# EAGLE schematic Battery_Board_v3.0 (EAGLE 9.6.2)
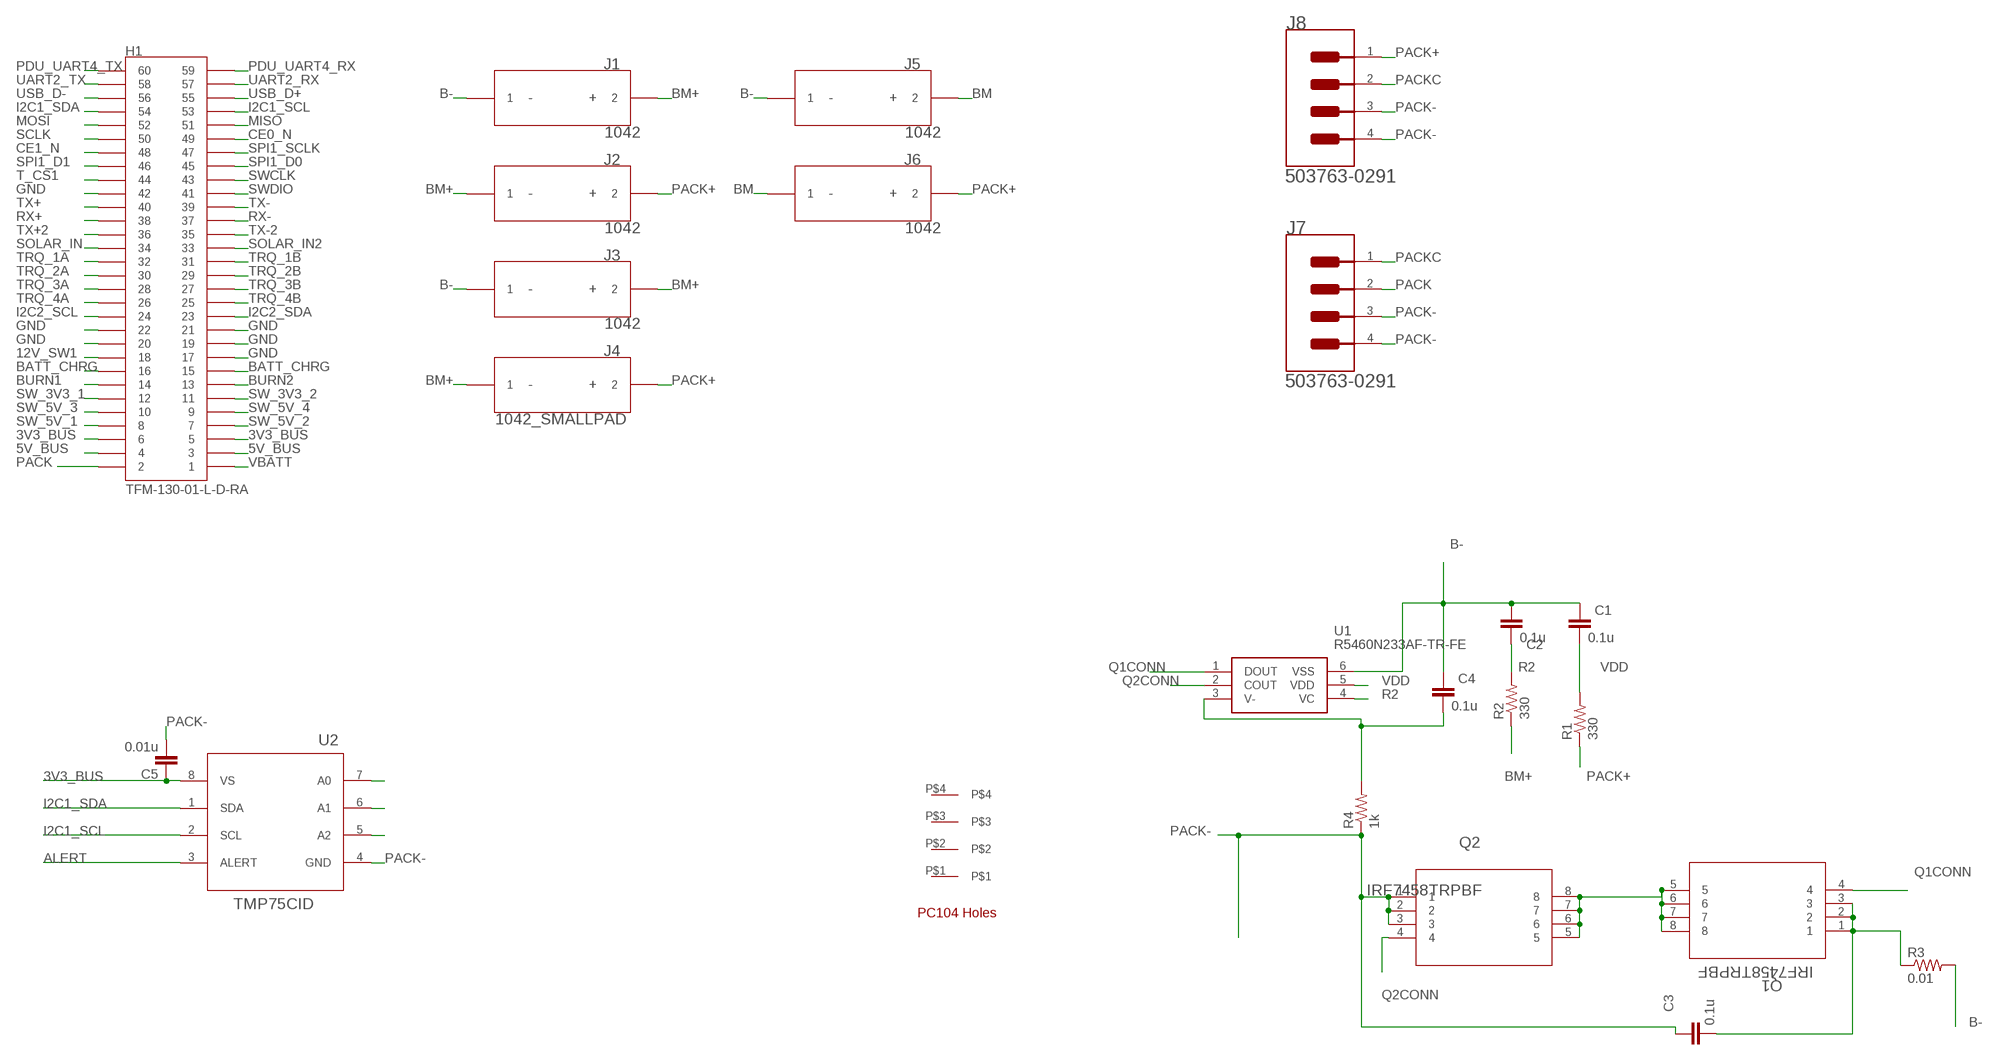
[diagram p0: schematic, sheet 1]

## Parts
C1  0.1u  CAP0603-CAP  [0603-CAP]
C2  0.1u  CAP0603-CAP  [0603-CAP]
C3  0.1u  CAP0603-CAP  [0603-CAP]
C4  0.1u  CAP0603-CAP  [0603-CAP]
C5  0.01u  CAP0805  [0805]
H1  TFM-130-01-L-D-RA  [60_PIN]
J1  1042  [1042_KEY]
J2  1042  [1042_KEY]
J3  1042  [1042_KEY]
J4  1042_SMALLPAD  [1042_KEY_SMALLPAD]
J5  1042  [1042_KEY]
J6  1042  [1042_KEY]
J7  MOLEX_503763-0291MOLEX_503763-0291_0_0  [MOLEX_503763-0291_0]
J8  MOLEX_503763-0291MOLEX_503763-0291_0_0  [MOLEX_503763-0291_0]
Q1  IRF7458TRPBF  [SO-8_IRF7458_3P9X4P9_INF]
Q2  IRF7458TRPBF  [SO-8_IRF7458_3P9X4P9_INF]
R1  330  RESISTOR0603-RES  [0603-RES]
R2  330  RESISTOR0603-RES  [0603-RES]
R3  0.01  RESISTOR2512  [R2512]
R4  1k  RESISTOR0603-RES  [0603-RES]
U1  R5460N233AF-TR-FE  [SOT95P280X140-6N]
U2  TMP75CID  [D0008A_N]
U$1  PC104_HOLES  [PC104_HOLES]

## Nets
3V3_BUS: C5.1 H1.5 H1.6 U2.8(VS)
5V_BUS: H1.3 H1.4
12V_SW1: H1.18
ALERT: U2.3(ALERT)
B-: C1.1 C2.1 C4.1 J1.1 J3.1 J5.1 R3.2 U1.6(VSS)
BATT_CHRG: H1.15 H1.16
BM: J5.2 J6.1
BM+: J1.2 J2.1 J3.2 J4.1 R2.1
BURN1: H1.14
BURN2: H1.13
CE0_N: H1.49
CE1_N: H1.48
GND: H1.17 H1.19 H1.20 H1.21 H1.22 H1.42
I2C1_SCL: H1.53 U2.2(SCL)
I2C1_SDA: H1.54 U2.1(SDA)
I2C2_SCL: H1.24
I2C2_SDA: H1.23
MISO: H1.51
MOSI: H1.52
N$2: C3.2 Q1.1 Q1.2 Q1.3 R3.1
N$4: C4.2 R4.2 U1.3(V-)
N$5: Q1.5 Q1.6 Q1.7 Q1.8 Q2.5 Q2.6 Q2.7 Q2.8
N$10: U2.5(A2)
N$11: U2.6(A1)
N$12: U2.7(A0)
PACK: H1.2 J7.2
PACK+: J2.2 J4.2 J6.2 J8.1 R1.1
PACK-: C3.1 C5.2 J7.3(MNT_1) J7.4(MNT_2) J8.3(MNT_1) J8.4(MNT_2) Q2.1 Q2.2 Q2.3 R4.1 U2.4(GND)
PACKC: J7.1 J8.2
PDU_UART4_RX: H1.59
PDU_UART4_TX: H1.60
Q1CONN: Q1.4 U1.1(DOUT)
Q2CONN: Q2.4 U1.2(COUT)
R2: C2.2 R2.2 U1.4(VC)
RX+: H1.38
RX-: H1.37
SCLK: H1.50
SOLAR_IN: H1.34
SOLAR_IN2: H1.33
SPI1_D0: H1.45
SPI1_D1: H1.46
SPI1_SCLK: H1.47
SW_3V3_1: H1.12
SW_3V3_2: H1.11
SW_5V_1: H1.8
SW_5V_2: H1.7
SW_5V_3: H1.10
SW_5V_4: H1.9
SWCLK: H1.43
SWDIO: H1.41
T_CS1: H1.44
TRQ_1A: H1.32
TRQ_1B: H1.31
TRQ_2A: H1.30
TRQ_2B: H1.29
TRQ_3A: H1.28
TRQ_3B: H1.27
TRQ_4A: H1.26
TRQ_4B: H1.25
TX+: H1.40
TX+2: H1.36
TX-: H1.39
TX-2: H1.35
UART2_RX: H1.57
UART2_TX: H1.58
USB_D+: H1.55
USB_D-: H1.56
VBATT: H1.1
VDD: C1.2 R1.2 U1.5(VDD)
Unconnected: U$1.P$1 U$1.P$2 U$1.P$3 U$1.P$4

## Library data of the parts
C1-C5 = HSFL_Main_Library (1):CAP: Capacitor Standard 0603 ceramic capacitor, and 0.1" leaded capacitor.
H1 = TFM-130-01-L-D-RA:TFM-130-01-L-D-RA
J1-J3 J5 J6 = Keystone_Electronics_1042:1042; COPYRIGHT: Copyright (C) 2021 Ultra Librarian. All rights reserved.; DIGI-KEY_PART_NUMBER_1: 1042L-ND; DIGI-KEY_PART_NUMBER_2: 2991-1042-ND; DIGI-KEY_PART_NUMBER_3: 36-1042-ND; DIGI-KEY_PART_NUMBER_4: KEY1066-ND; MANUFACTURER_PART_NUMBER: 1042; MFR_NAME: Keystone Electronics
J4 = Keystone_Electronics_1042:1042_SMALLPAD
J7 J8 = Molex - 503763-0291:MOLEX_503763-0291: 2 Positions Header Connector 0.039" (1.00mm) Surface Mount, Right Angle Gold; CENTROID_NOT_SPECIFIED: No; DATASHEET: http://www.molex.com/pdm_docs/sd/5037630291_sd.pdf; DIGIKEY_DESCRIPTION: CONN HEADER 1MM R/A 2CKT; DIGIKEY_PART_NUMBER: WM10654CT-ND; LEAD_FREE: yes; MF: Molex; MOUSER_PART_NUMBER: 538-503763-0291; MPN: 503763-0291; PACKAGE: HDR02; PREFIX: J; ROHS: yes; TEMPERATURE_RANGE_HIGH: +105°C; TEMPERATURE_RANGE_LOW: -40°C
Q1 Q2 = IRF7458:IRF7458TRPBF; COPYRIGHT: Copyright (C) 2021 Ultra Librarian. All rights reserved.; MANUFACTURER_PART_NUMBER: IRF7458TRPBF; MFR_NAME: Infineon
R1-R4 = HSFL_Main_Library (1):RESISTOR: Resistor Basic schematic elements and footprints for 0603, 1206, and PTH resistors.
U1 = SamacSys_Parts:R5460N233AF-TR-FE: Battery Management 2-Cell Li-ion Protection IC Source: Datasheet; DESCRIPTION: Battery Management 2-Cell Li-ion Protection IC; HEIGHT: 1.4mm; MANUFACTURER_NAME: Ricoh; MANUFACTURER_PART_NUMBER: R5460N233AF-TR-FE; MOUSER_PART_NUMBER: 848-R5460N233AFTRFE; MOUSER_PRICE-STOCK: https://www.mouser.co.uk/ProductDetail/Ricoh-Electronic-Devices-Company/R5460N233AF-TR-FE?qs=0lQeLiL1qyZJIzN8jBJcMQ%3D%3D
U2 = TMP75CID:TMP75CID; COPYRIGHT: Copyright (C) 2023 Ultra Librarian. All rights reserved.; MANUFACTURER_PART_NUMBER: TMP75CID; MFR_NAME: Texas Instruments; REFDES: RefDes; TYPE: TYPE
U$1 = PC104_holes:PC104_HOLES